# EAGLE board Jupiter Ace build024 (EAGLE 9.6.2), part 1 of 3
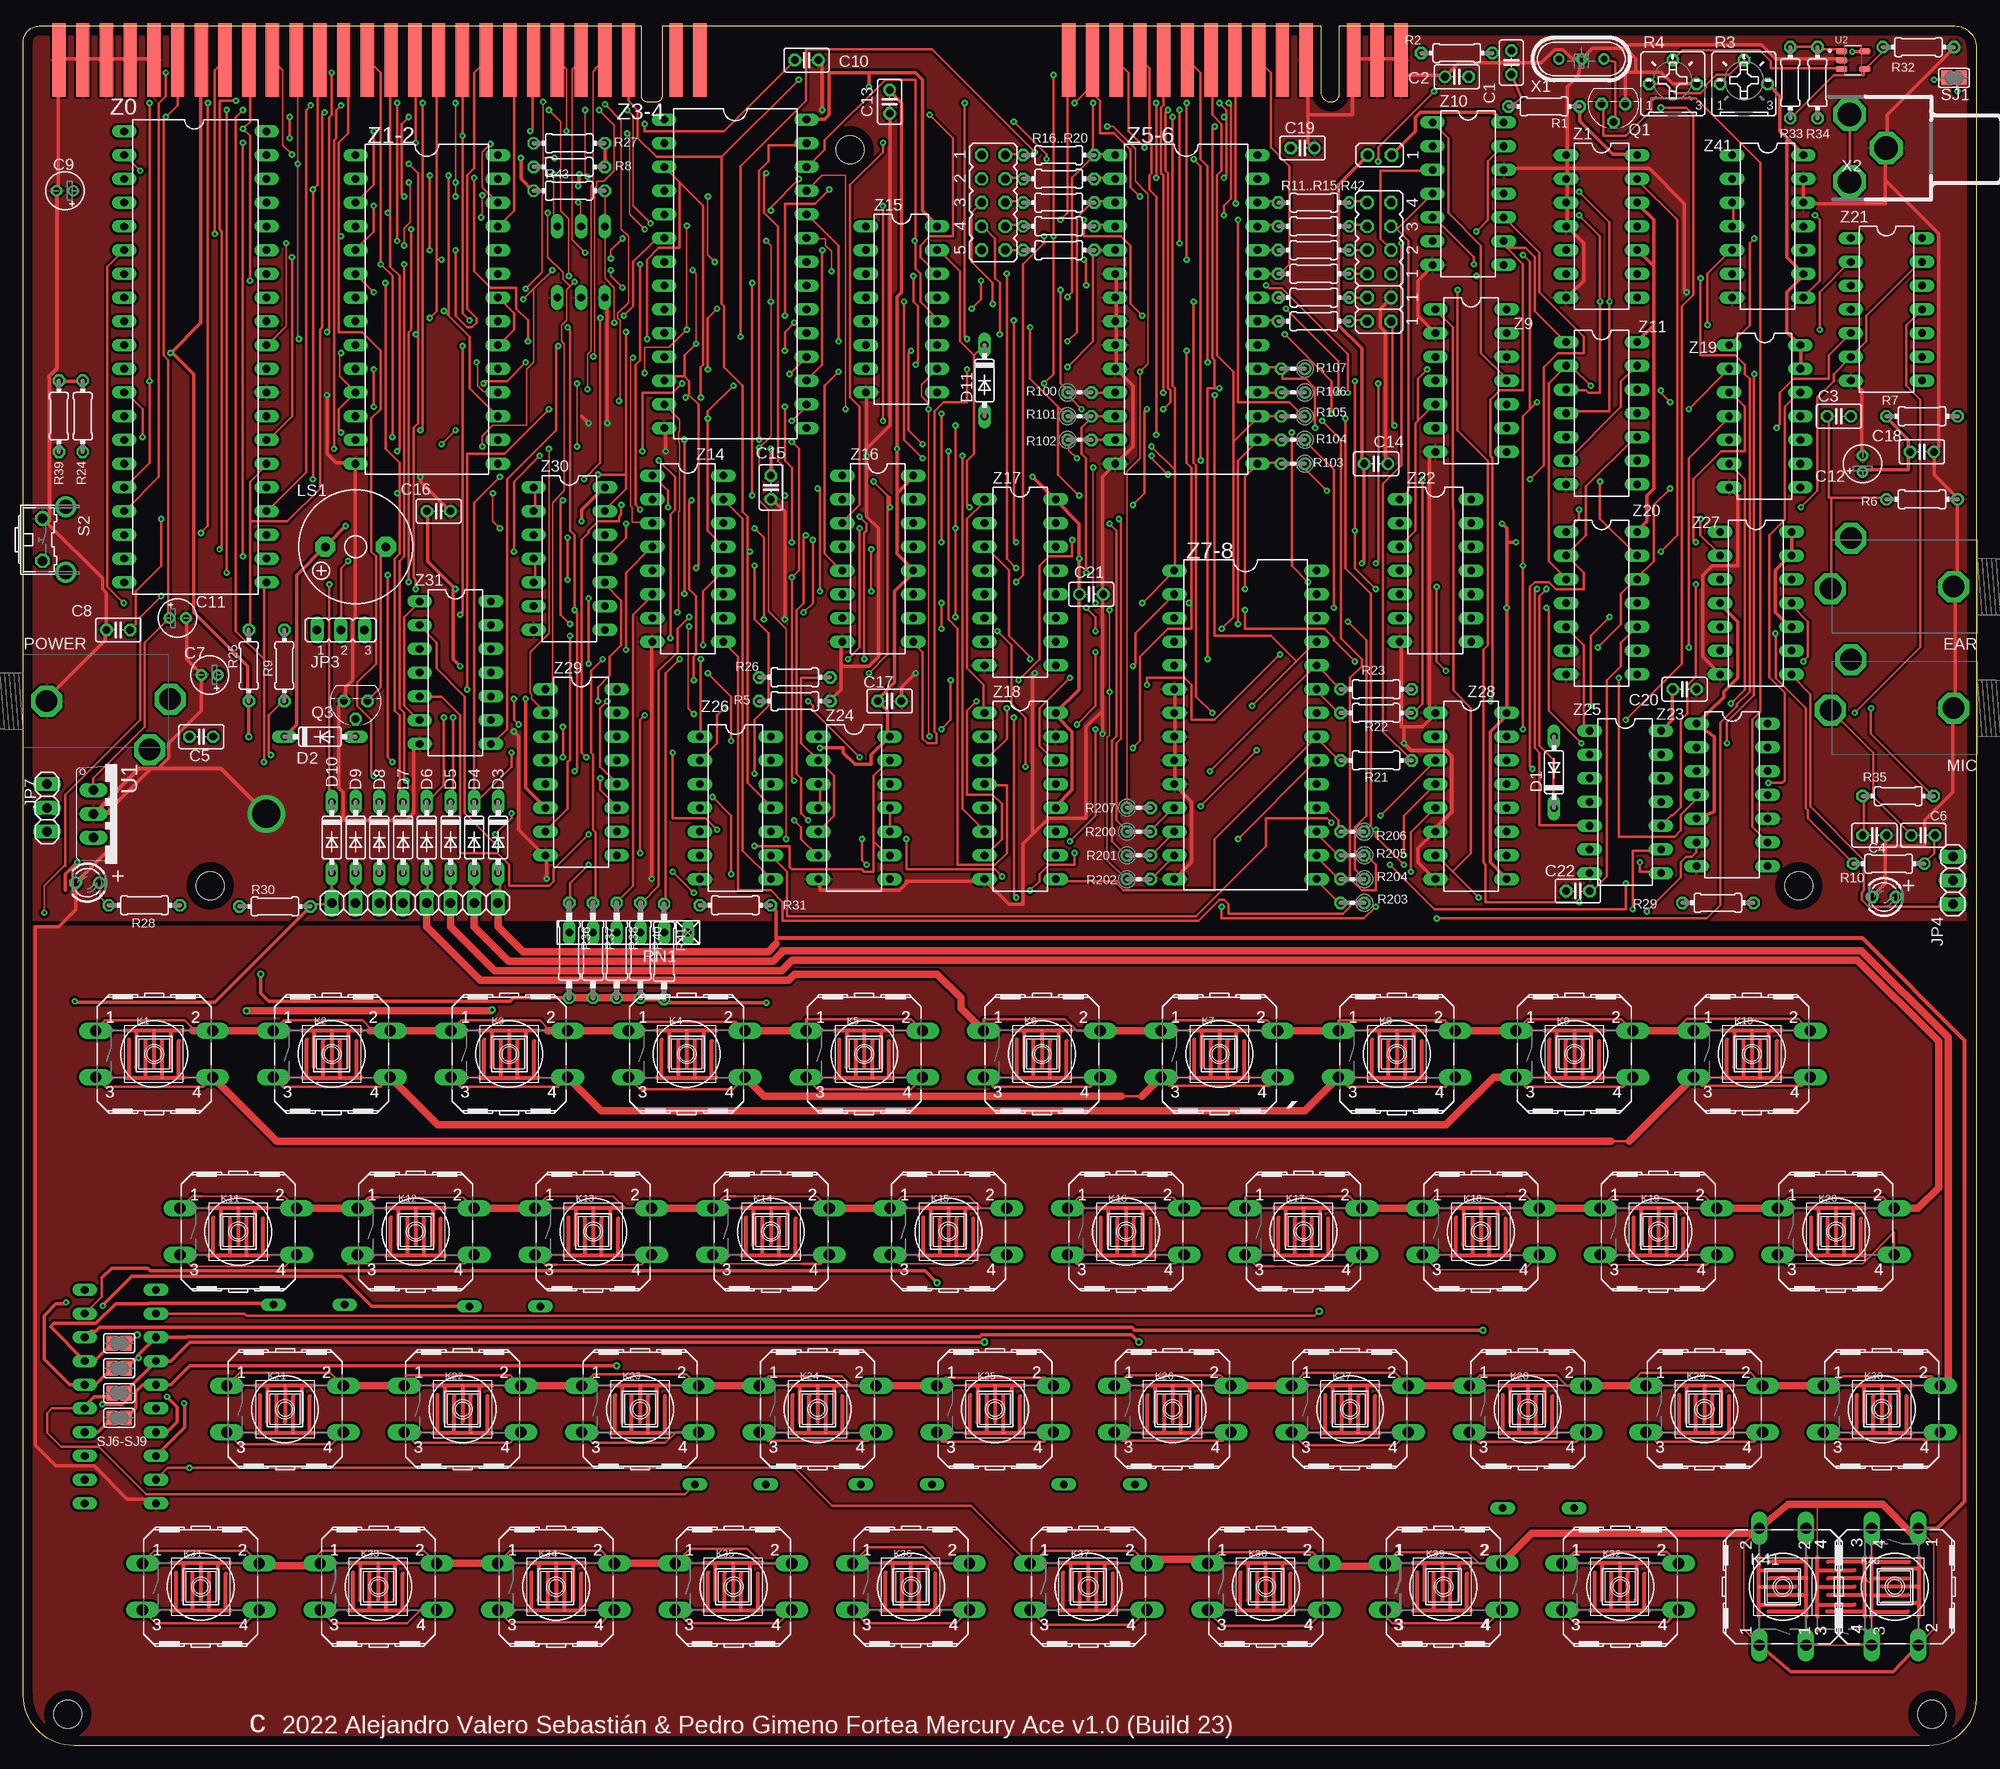
[diagram p6: board, top side]
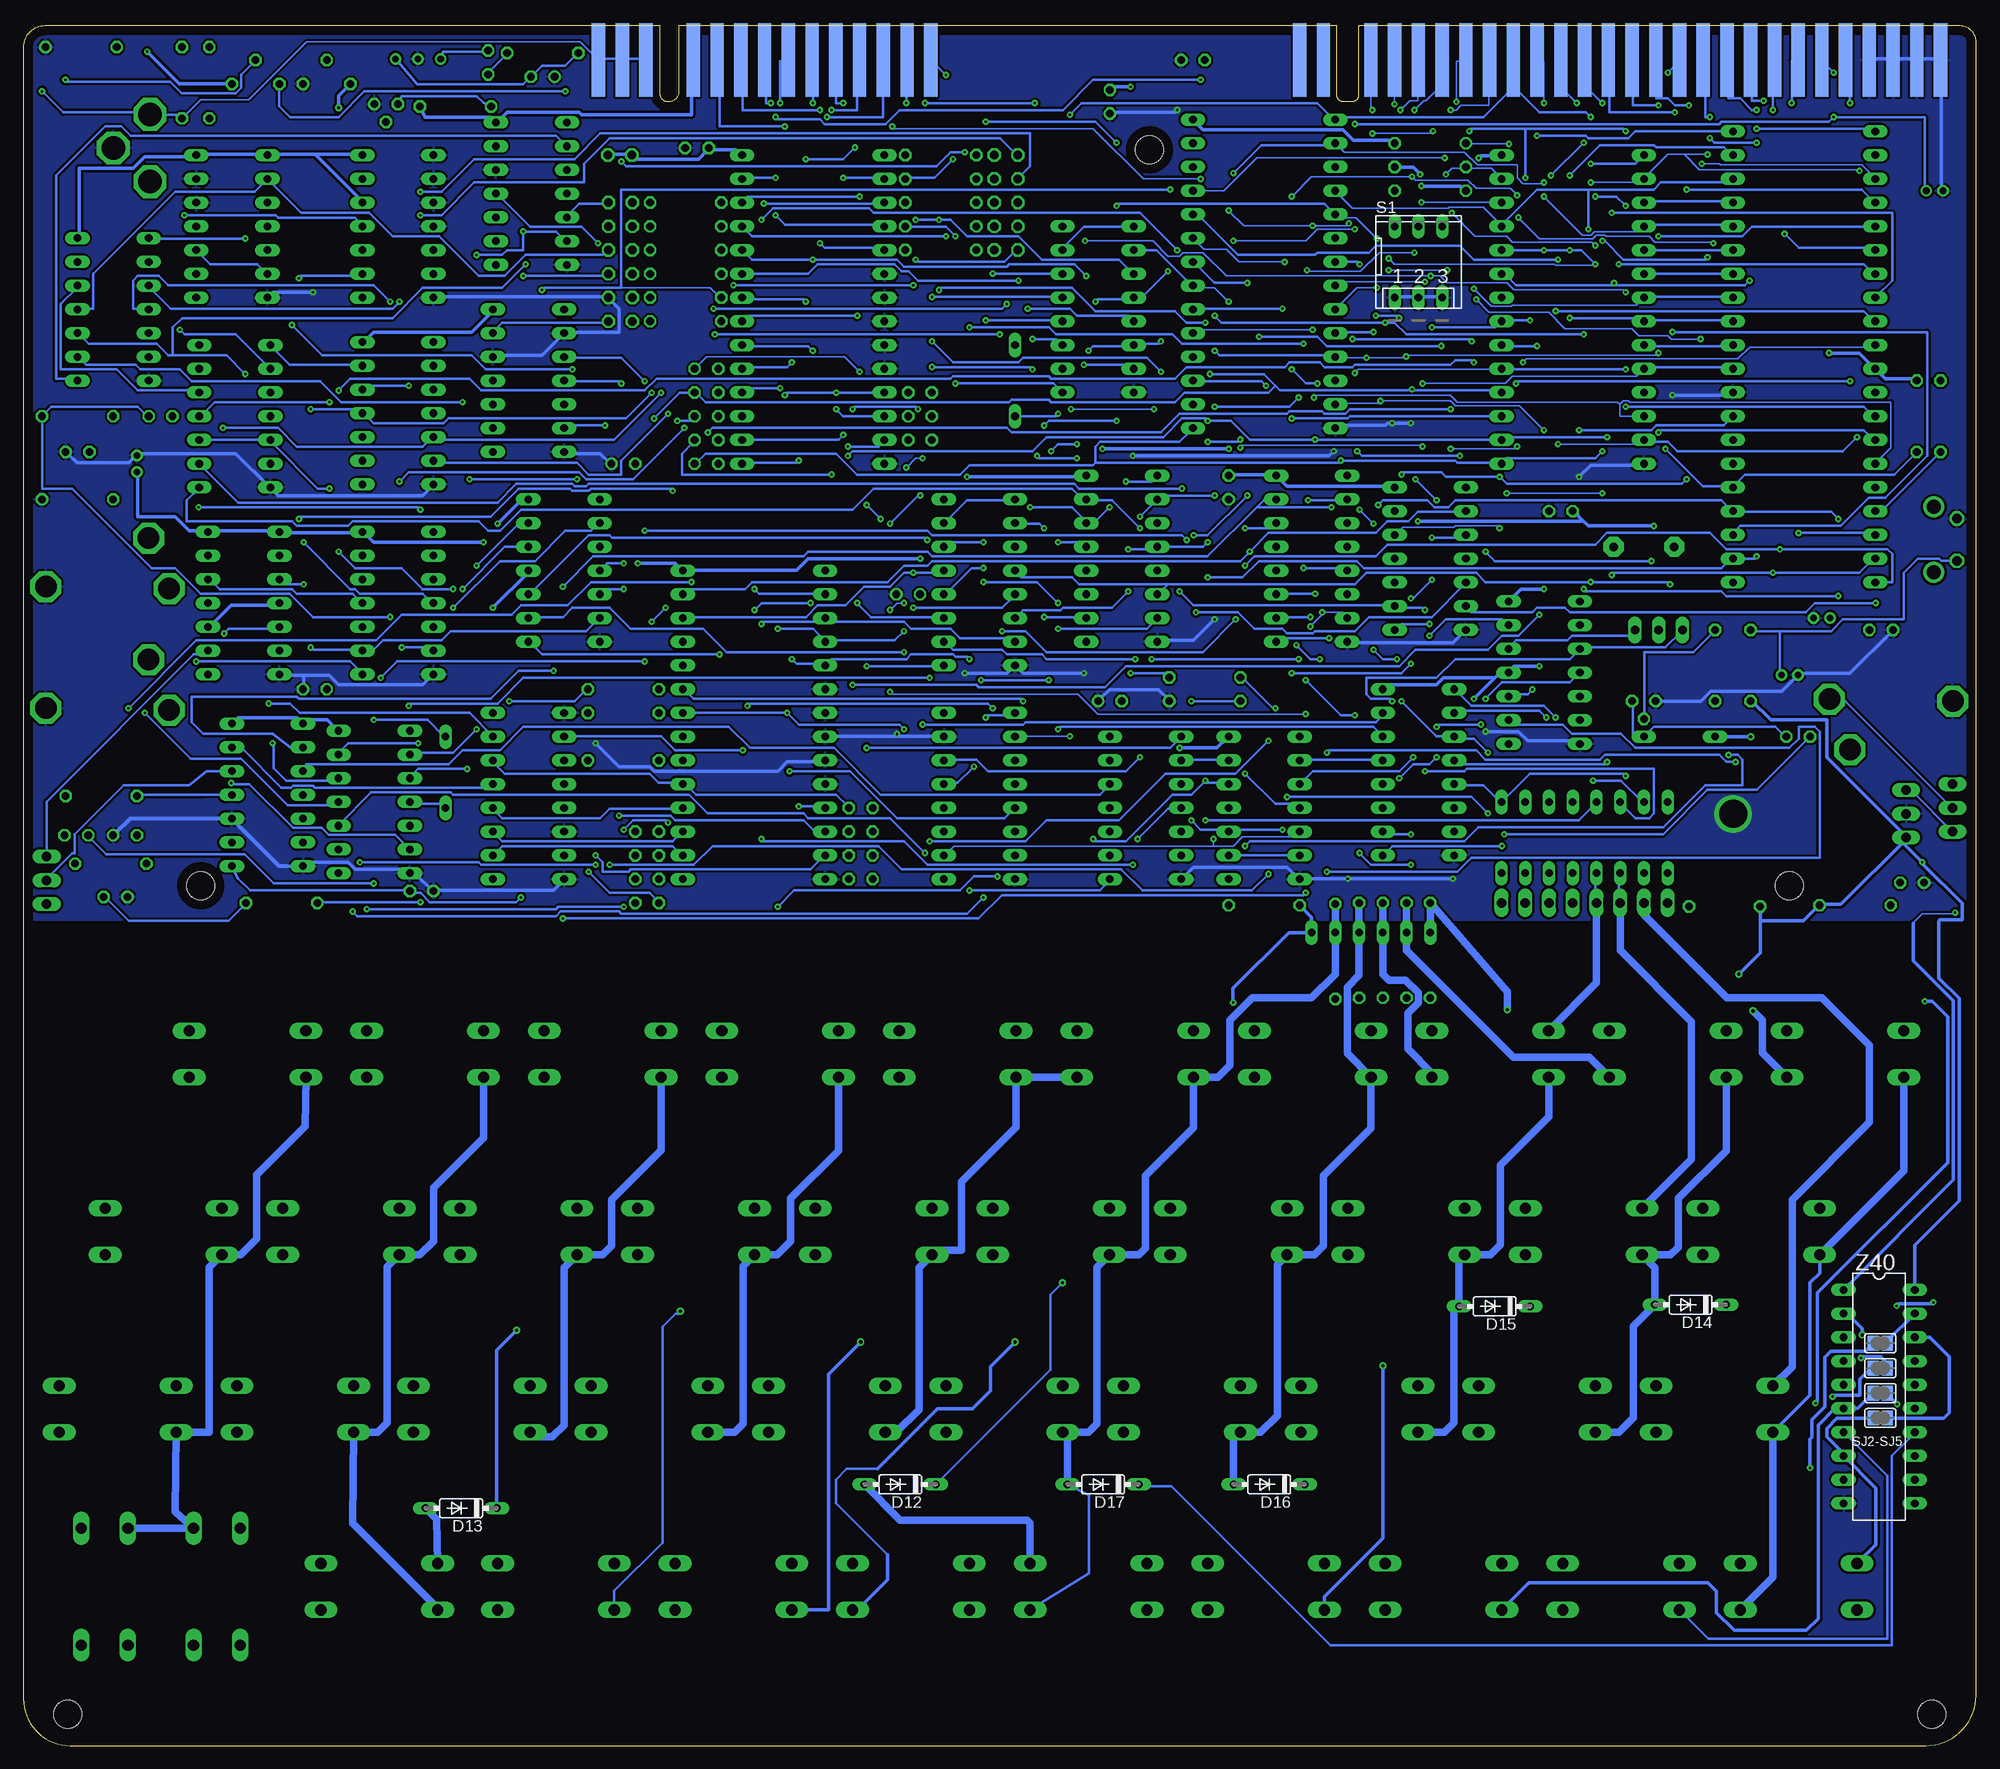
[diagram p7: board, bottom side, seen from below]

Size 209 x 184 mm. Coordinates in mm from the lower left corner, seen from the top.
Outline: 0,5.39 0,182.31 arc-90 1.69,184 66.1,184 66.1,176.56 arc90 66.77,175.9 67.77,175.9 arc90 68.4,176.53 68.4,184 138.86,184 138.86,176.98 arc90 139.96,175.87 arc90 140.86,176.77 140.86,184 206.72,184 arc-90 209,181.72 209,5.01 arc-90 203.99,0 5.39,0 arc-90 0,5.39
Copper layers (1*16): Top 0.035mm / dielectric 1.5mm / Bottom 0.035mm
Design rules "default *": minimum track width 6mil, minimum drill 10mil, track to track 8mil, track to pad 8mil, pad to pad 8mil, via to via 8mil, smd to smd 8mil, copper to edge 40mil, drill to drill 8mil, minimum pad ring 10mil, minimum via ring 8mil, stop-mask expansion 4mil, vias tented up to drill 0mil, thermal gap 10mil
Net classes: 0 default: width 0.1 mm; 1 power: width 0.4 mm
Holes 3 mm at 20,92 190,92 88.5,170.75 4.76,3.37 204.24,3.37
bKeepout: 1 lines
tRestrict: 1 lines
bRestrict: 1 lines
vRestrict: area 14,91.4 to 29.2,101.6

## Footprints (pad centres in the part's own frame; a part is rotated, then mirrored left to right if it is on the bottom)
EDGEPIN = smd 1.422 x 7.874: 1 0,0
C025-025X050 = drill 0.813 octagon: 1 -1.27,0; 2 1.27,0
E1,8-4 = drill 0.711 pad 1.168: + -0.889,0 | drill 0.711 pad 1.168 octagon: - 0.889,0
DO35-7 = drill 0.813 long: A 3.81,0; C -3.81,0
PJ302M = drill 2.3 pad 3.3 octagon: GND 2.5,0; SW 13.5,-5.2; TIP 15.7,0.2
1X08 = drill 1.016 long: 1 -8.89,0; 2 -6.35,0; 3 -3.81,0; 4 -1.27,0; 5 1.27,0; 6 3.81,0; 7 6.35,0; 8 8.89,0
JP2 = drill 0.914 long: 1 -2.54,0; 2 0,0; 3 2.54,0
1X03 = drill 1.016 long: 1 -2.54,0; 2 0,0; 3 2.54,0
JP1Q = drill 0.914 octagon: 1 -1.27,-1.27; 2 -1.27,1.27
JP4Q = drill 0.914 octagon: 1 -3.81,-1.27; 2 -3.81,1.27; 3 -1.27,-1.27; 4 -1.27,1.27; 5 1.27,-1.27; 6 1.27,1.27; 7 3.81,-1.27; 8 3.81,1.27
JP5Q = drill 0.914 octagon: 1 -5.08,-1.27; 2 -5.08,1.27; 3 -2.54,-1.27; 4 -2.54,1.27; 5 0,-1.27; 6 0,1.27; 7 2.54,-1.27; 8 2.54,1.27; 9 5.08,-1.27; 10 5.08,1.27
B3F-40XXNOHOLE = drill 1.194 long: 1 -6.248,2.489; 2 6.248,2.489; 3 -6.248,-2.489; 4 6.248,-2.489
LED3MM = drill 0.813 octagon: A -1.27,0; K 1.27,0
F/QMX = drill 0.914 pad 2.159 octagon: + 3.251,0; - -3.251,0
TO92 = drill 0.813 octagon: 1 1.27,0; 2 0,1.905; 3 -1.27,0
0204/7 = drill 0.813 octagon: 1 -3.81,0; 2 3.81,0
B25P = drill 0.813 octagon: A -2.54,0; E 2.54,0; S 0,2.54
0207/10 = drill 0.813 octagon: 1 -5.08,0; 2 5.08,0
0204V = drill 0.813 octagon: 1 -1.27,0; 2 1.27,0
RN-6 = drill 0.813 long: 1 -6.35,0; 2 -3.81,0; 3 -1.27,0; 4 1.27,0; 5 3.81,0; 6 6.35,0
DP-03 = drill 0.813 long: 1 -2.54,-3.81; 2 0,-3.81; 3 2.54,-3.81; 4 2.54,3.81; 5 0,3.81; 6 -2.54,3.81
B3F-31XX = drill 1.016 octagon: 1 -2.261,-1.245; 2 2.261,-1.245 | drill 1.499 pad 2.159: 3 -3.505,1.245; 4 3.505,1.245
SJ = smd 1.168 x 1.6: 1 -0.762,0; 2 0.762,0
TO220V = drill 1.016 long: 1 -2.54,-2.54; 2 0,-2.54; 3 2.54,-2.54
SOT95P280X145-5N = smd 1.22 x 0.6: 1 -1.245,0.95; 2 -1.245,0; 3 -1.245,-0.95; 4 1.245,-0.95; 5 1.245,0.95
CARBONB3F = smd 0.305 x 0.152: P$1 0,2.54; P$2 0.889,-2.54
HC49U = drill 0.7 pad 1.2: 1 -2.413,0; 2 -0.027,0; 3 2.413,0
CON-CONRAD_736880-49 = drill 2.5 pad 3.302 octagon: 1 -0.11,0; 2 3.81,3.595; 2@2 3.81,-3.595
DIL40 = drill 0.813 long: 1 -24.13,-7.62; 2 -21.59,-7.62; 3 -19.05,-7.62; 4 -16.51,-7.62; 5 -13.97,-7.62; 6 -11.43,-7.62; 7 -8.89,-7.62; 8 -6.35,-7.62; 9 -3.81,-7.62; 10 -1.27,-7.62; 11 1.27,-7.62; 12 3.81,-7.62; 13 6.35,-7.62; 14 8.89,-7.62; 15 11.43,-7.62; 16 13.97,-7.62; 17 16.51,-7.62; 18 19.05,-7.62; 19 21.59,-7.62; 20 24.13,-7.62; 21 24.13,7.62; 22 21.59,7.62; 23 19.05,7.62; 24 16.51,7.62; 25 13.97,7.62; 26 11.43,7.62; 27 8.89,7.62; 28 6.35,7.62; 29 3.81,7.62; 30 1.27,7.62; 31 -1.27,7.62; 32 -3.81,7.62; 33 -6.35,7.62; 34 -8.89,7.62; 35 -11.43,7.62; 36 -13.97,7.62; 37 -16.51,7.62; 38 -19.05,7.62; 39 -21.59,7.62; 40 -24.13,7.62
DIL14 = drill 0.813 long: 1 -7.62,-3.81; 2 -5.08,-3.81; 3 -2.54,-3.81; 4 0,-3.81; 5 2.54,-3.81; 6 5.08,-3.81; 7 7.62,-3.81; 8 7.62,3.81; 9 5.08,3.81; 10 2.54,3.81; 11 0,3.81; 12 -2.54,3.81; 13 -5.08,3.81; 14 -7.62,3.81
DIL28-6 = drill 0.813 long: 1 -16.51,-7.62; 2 -13.97,-7.62; 3 -11.43,-7.62; 4 -8.89,-7.62; 5 -6.35,-7.62; 6 -3.81,-7.62; 7 -1.27,-7.62; 8 1.27,-7.62; 9 3.81,-7.62; 10 6.35,-7.62; 11 8.89,-7.62; 12 11.43,-7.62; 13 13.97,-7.62; 14 16.51,-7.62; 15 16.51,7.62; 16 13.97,7.62; 17 11.43,7.62; 18 8.89,7.62; 19 6.35,7.62; 20 3.81,7.62; 21 1.27,7.62; 22 -1.27,7.62; 23 -3.81,7.62; 24 -6.35,7.62; 25 -8.89,7.62; 26 -11.43,7.62; 27 -13.97,7.62; 28 -16.51,7.62
DIL16 = drill 0.813 long: 1 -8.89,-3.81; 2 -6.35,-3.81; 3 -3.81,-3.81; 4 -1.27,-3.81; 5 1.27,-3.81; 6 3.81,-3.81; 7 6.35,-3.81; 8 8.89,-3.81; 9 8.89,3.81; 10 6.35,3.81; 11 3.81,3.81; 12 1.27,3.81; 13 -1.27,3.81; 14 -3.81,3.81; 15 -6.35,3.81; 16 -8.89,3.81
DIL20 = drill 0.813 long: 1 -11.43,-3.81; 2 -8.89,-3.81; 3 -6.35,-3.81; 4 -3.81,-3.81; 5 -1.27,-3.81; 6 1.27,-3.81; 7 3.81,-3.81; 8 6.35,-3.81; 9 8.89,-3.81; 10 11.43,-3.81; 11 11.43,3.81; 12 8.89,3.81; 13 6.35,3.81; 14 3.81,3.81; 15 1.27,3.81; 16 -1.27,3.81; 17 -3.81,3.81; 18 -6.35,3.81; 19 -8.89,3.81; 20 -11.43,3.81

## Placement (x,y rotation side)
1A  [EDGEPIN]  11.43,180.34 0 top
1A1  [EDGEPIN]  111.89,180.34 0 top
1B  [EDGEPIN]  11.43,180.34 0 bottom
1B1  [EDGEPIN]  111.89,180.34 0 bottom
2A  [EDGEPIN]  13.97,180.34 0 top
2A1  [EDGEPIN]  114.43,180.34 0 top
2B  [EDGEPIN]  13.97,180.34 0 bottom
2B1  [EDGEPIN]  114.43,180.34 0 bottom
3A  [EDGEPIN]  16.51,180.34 0 top
3A1  [EDGEPIN]  116.97,180.34 0 top
3B  [EDGEPIN]  16.51,180.34 0 bottom
3B1  [EDGEPIN]  116.97,180.34 0 bottom
4A  [EDGEPIN]  19.05,180.34 0 top
4A1  [EDGEPIN]  119.51,180.34 0 top
4B  [EDGEPIN]  19.05,180.34 0 bottom
4B2  [EDGEPIN]  119.51,180.34 0 bottom
5A  [EDGEPIN]  21.59,180.34 0 top
5A1  [EDGEPIN]  122.05,180.34 0 top
5B  [EDGEPIN]  21.59,180.34 0 bottom
5B2  [EDGEPIN]  122.05,180.34 0 bottom
6A  [EDGEPIN]  24.13,180.34 0 top
6A1  [EDGEPIN]  124.59,180.34 0 top
6B  [EDGEPIN]  24.13,180.34 0 bottom
6B2  [EDGEPIN]  124.59,180.34 0 bottom
7A  [EDGEPIN]  26.67,180.34 0 top
7A1  [EDGEPIN]  127.13,180.34 0 top
7B  [EDGEPIN]  26.67,180.34 0 bottom
7B2  [EDGEPIN]  127.13,180.34 0 bottom
8A  [EDGEPIN]  29.21,180.34 0 top
8A1  [EDGEPIN]  129.67,180.34 0 top
8B  [EDGEPIN]  29.21,180.34 0 bottom
8B2  [EDGEPIN]  129.67,180.34 0 bottom
9A  [EDGEPIN]  31.75,180.34 0 top
9A1  [EDGEPIN]  132.21,180.34 0 top
9B  [EDGEPIN]  31.75,180.34 0 bottom
9B1  [EDGEPIN]  132.21,180.34 0 bottom
10A  [EDGEPIN]  34.29,180.34 0 top
10A1  [EDGEPIN]  134.75,180.34 0 top
10B  [EDGEPIN]  34.29,180.34 0 bottom
10B1  [EDGEPIN]  134.75,180.34 0 bottom
11A  [EDGEPIN]  36.83,180.34 0 top
11A1  [EDGEPIN]  137.29,180.34 0 top
11B  [EDGEPIN]  36.83,180.34 0 bottom
11B1  [EDGEPIN]  137.29,180.34 0 bottom
12A  [EDGEPIN]  39.37,180.34 0 top
12B  [EDGEPIN]  39.37,180.34 0 bottom
13A  [EDGEPIN]  41.91,180.34 0 top
13A1  [EDGEPIN]  142.37,180.34 0 top
13B  [EDGEPIN]  41.91,180.34 0 bottom
13B1  [EDGEPIN]  142.37,180.34 0 bottom
14A  [EDGEPIN]  44.45,180.34 0 top
14A1  [EDGEPIN]  144.91,180.34 0 top
14B  [EDGEPIN]  44.45,180.34 0 bottom
14B1  [EDGEPIN]  144.91,180.34 0 bottom
15A  [EDGEPIN]  46.99,180.34 0 top
15A1  [EDGEPIN]  147.45,180.34 0 top
15B  [EDGEPIN]  46.99,180.34 0 bottom
15B1  [EDGEPIN]  147.45,180.34 0 bottom
16A  [EDGEPIN]  49.53,180.34 0 top
16B  [EDGEPIN]  49.53,180.34 0 bottom
17A  [EDGEPIN]  52.07,180.34 0 top
17B  [EDGEPIN]  52.07,180.34 0 bottom
18A  [EDGEPIN]  54.61,180.34 0 top
18B  [EDGEPIN]  54.61,180.34 0 bottom
19A  [EDGEPIN]  57.15,180.34 0 top
19B  [EDGEPIN]  57.15,180.34 0 bottom
20A  [EDGEPIN]  59.69,180.34 0 top
20B  [EDGEPIN]  59.69,180.34 0 bottom
21A  [EDGEPIN]  62.23,180.34 0 top
21B  [EDGEPIN]  62.23,180.34 0 bottom
22A  [EDGEPIN]  64.77,180.34 0 top
22B  [EDGEPIN]  64.77,180.34 0 bottom
24A  [EDGEPIN]  69.85,180.34 0 top
24B  [EDGEPIN]  69.85,180.34 0 bottom
25A  [EDGEPIN]  72.39,180.34 0 top
25B  [EDGEPIN]  72.39,180.34 0 bottom
26A  [EDGEPIN]  8.89,180.34 0 top
26B  [EDGEPIN]  8.89,180.34 0 bottom
27A  [EDGEPIN]  6.35,180.34 0 top
27B  [EDGEPIN]  6.35,180.34 0 bottom
28A  [EDGEPIN]  3.81,180.34 0 top
28B  [EDGEPIN]  3.81,180.34 0 bottom
C1  30pF  [C025-025X050]  159.26,180.09 270 top
C2  100pF  [C025-025X050]  153.42,178.56 180 top
C3  2.2uF  [C025-025X050]  194.31,142.24 0 top
C4  100nF  [C025-025X050]  198.12,97.41 180 top
C5  47pF  [C025-025X050]  19.05,107.95 0 top
C6  47nF  [C025-025X050]  203.33,97.41 0 top
C7  1uF  [E1,8-4]  19.94,114.55 180 top
C8  2.2nF  [C025-025X050]  10.16,119.38 180 top
C9  100uF  [E1,8-4]  4.45,166.37 180 top
C10  100nF  [C025-025X050]  83.82,180.34 0 top
C11  1uF  [E1,8-4]  16.51,120.65 0 top
C12  1uF  [E1,8-4]  196.85,137.16 90 top
C13  100nF  [C025-025X050]  92.71,175.9 90 top
C14  100nF  [C025-025X050]  144.78,137.16 180 top
C15  100nF  [C025-025X050]  80.01,134.62 90 top
C16  100nF  [C025-025X050]  44.45,132.08 180 top
C17  100nF  [C025-025X050]  92.71,111.76 180 top
C18  100nF  [C025-025X050]  203.2,138.43 180 top
C19  100nF  [C025-025X050]  136.91,170.94 180 top
C20  100nF  [C025-025X050]  177.8,113.03 180 top
C21  100nF  [C025-025X050]  114.3,123.19 180 top
C22  470pF  [C025-025X050]  166.37,91.44 0 top
D1  1N4148DO35-7  [DO35-7]  163.83,104.14 90 top
D2  1N4148DO35-7  [DO35-7]  31.75,107.95 0 top
D3  1N4148DO35-7  [DO35-7]  50.8,97.16 270 top
D4  1N4148DO35-7  [DO35-7]  48.26,97.16 270 top
D5  1N4148DO35-7  [DO35-7]  45.72,97.16 270 top
D6  1N4148DO35-7  [DO35-7]  43.18,97.16 270 top
D7  1N4148DO35-7  [DO35-7]  40.64,97.16 270 top
D8  1N4148DO35-7  [DO35-7]  38.1,97.16 270 top
D9  1N4148DO35-7  [DO35-7]  35.56,97.16 270 top
D10  1N4148DO35-7  [DO35-7]  33.02,97.16 270 top
D11  1N4148DO35-7  [DO35-7]  102.87,146.05 270 top
D12  1N4148DO35-7  [DO35-7]  115.16,27.94 180 bottom
D13  1N4148DO35-7  [DO35-7]  162.15,25.4 180 bottom
D14  1N4148DO35-7  [DO35-7]  30.57,47.18 180 bottom
D15  1N4148DO35-7  [DO35-7]  51.53,46.99 180 bottom
D16  1N4148DO35-7  [DO35-7]  75.66,27.94 180 bottom
D17  1N4148DO35-7  [DO35-7]  93.44,27.94 180 bottom
EAR  PJ302M  [PJ302M]  209.1,124 180 top
JP1  ROWS  [1X08]  41.91,90.17 0 top
JP3  MEMORY  [JP2]  33.97,119.38 0 top
JP4  VIDEO  [1X03]  206.5,92.58 270 top
JP5  [JP1Q]  145.1,153.67 90 top
JP6  ACE81_ENABLED  [JP1Q]  145.1,156.21 90 top
JP7  POWER  [1X03]  2.54,100.33 90 top
JP8  VCC  [JP1Q]  145.16,171.45 90 top
JP10  [JP4Q]  145.1,161.29 90 top
JP15  [JP5Q]  103.82,165.1 270 top
K1  1  [B3F-40XXNOHOLE]  14,74 0 top
K2  2  [B3F-40XXNOHOLE]  33,74 0 top
K3  3  [B3F-40XXNOHOLE]  52,74 0 top
K4  4  [B3F-40XXNOHOLE]  71,74 0 top
K5  5  [B3F-40XXNOHOLE]  90,74 0 top
K6  6  [B3F-40XXNOHOLE]  109,74 0 top
K7  7  [B3F-40XXNOHOLE]  128,74 0 top
K8  8  [B3F-40XXNOHOLE]  147,74 0 top
K9  9  [B3F-40XXNOHOLE]  166,74 0 top
K10  0  [B3F-40XXNOHOLE]  185,74 0 top
K11  Q  [B3F-40XXNOHOLE]  23,55 0 top
K12  W  [B3F-40XXNOHOLE]  42,55 0 top
K13  E  [B3F-40XXNOHOLE]  61,55 0 top
K14  R  [B3F-40XXNOHOLE]  80,55 0 top
K15  T  [B3F-40XXNOHOLE]  99,55 0 top
K16  Y  [B3F-40XXNOHOLE]  118,55 0 top
K17  U  [B3F-40XXNOHOLE]  137,55 0 top
K18  I  [B3F-40XXNOHOLE]  156,55 0 top
K19  O  [B3F-40XXNOHOLE]  175,55 0 top
K20  P  [B3F-40XXNOHOLE]  194,55 0 top
K21  A  [B3F-40XXNOHOLE]  28,36 0 top
K22  S  [B3F-40XXNOHOLE]  47,36 0 top
K23  D  [B3F-40XXNOHOLE]  66,36 0 top
K24  F  [B3F-40XXNOHOLE]  85,36 0 top
K25  G  [B3F-40XXNOHOLE]  104,36 0 top
K26  H  [B3F-40XXNOHOLE]  123,36 0 top
K27  J  [B3F-40XXNOHOLE]  142,36 0 top
K28  K  [B3F-40XXNOHOLE]  161,36 0 top
K29  L  [B3F-40XXNOHOLE]  179.9,36 0 top
K30  ENTER  [B3F-40XXNOHOLE]  198.9,36 0 top
K31  SHIFT  [B3F-40XXNOHOLE]  19,17 0 top
K32  SYMBOL  [B3F-40XXNOHOLE]  170.9,17 0 top
K33  Z  [B3F-40XXNOHOLE]  38,17 0 top
K34  X  [B3F-40XXNOHOLE]  57,17 0 top
K35  C  [B3F-40XXNOHOLE]  76,17 0 top
K36  V  [B3F-40XXNOHOLE]  95,17 0 top
K37  B  [B3F-40XXNOHOLE]  114,17 0 top
K38  N  [B3F-40XXNOHOLE]  133,17 0 top
K39  M  [B3F-40XXNOHOLE]  152,17 0 top
K40  SPACE  [B3F-40XXNOHOLE]  200.3,17 270 top
K41  SPACE  [B3F-40XXNOHOLE]  188.3,17 90 top
LED1  POWER  [LED3MM]  6.86,92.33 180 top
LED2  ACE81  [LED3MM]  199.14,90.81 180 top
LS1  F/QMX  [F/QMX]  35.56,128.27 180 top
MIC  PJ302M  [PJ302M]  209.1,111 180 top
POWER  PJ302M  [PJ302M]  0,111.76 0 top
Q1  2N3904  [TO92]  170.18,175.64 180 top
Q3  BC337  [TO92]  35.56,111.76 180 top
R1  1K  [0204/7]  162.75,175.39 180 top
R2  47K  [0204/7]  153.42,181.1 0 top
R3  500R  [B25P]  184.15,177.8 0 top
R4  1K  [B25P]  176.53,177.8 0 top
R5  12K  [0204/7]  82.55,111.76 180 top
R6  1K  [0204/7]  203.2,133.35 180 top
R7  33K  [0204/7]  203.2,142.24 180 top
R8  10K  [0204/7]  58.42,168.91 180 top
R9  22K  [0204/7]  27.94,115.57 270 top
R10  10K  [0204/7]  199.64,94.36 180 top
R11  1K  [0204/7]  138.11,152.4 180 top
R12  1K  [0204/7]  138.11,157.48 180 top
R13  1K  [0204/7]  138.11,160.02 180 top
R14  1K  [0204/7]  138.11,162.56 180 top
R15  1K  [0204/7]  138.11,165.1 180 top
R16  1K  [0204/7]  110.81,170.18 0 top
R17  1K  [0204/7]  110.81,167.64 0 top
R18  1K  [0204/7]  110.81,165.1 0 top
R19  1K  [0204/7]  110.81,162.56 0 top
R20  1K  [0204/7]  110.81,160.02 0 top
R21  1K  [0204/7]  144.78,105.41 180 top
R22  1K  [0204/7]  144.78,110.49 180 top
R23  1K  [0204/7]  144.78,113.03 180 top
R24  10K  [0204/7]  6.35,142.24 90 top
R25  220K  [0204/7]  24.13,115.57 270 top
R26  330  [0204/7]  82.55,114.3 0 top
R27  10K  [0204/7]  58.42,171.45 180 top
R28  680  [0204/7]  12.95,89.92 180 top
R29  680  [0204/7]  181.36,90.17 180 top
R30  4k7  [0204/7]  26.92,89.79 0 top
R31  4K7  [0204/7]  76.2,89.92 0 top
R32  200  [0204/7]  202.82,181.74 180 top
R33  200  [0204/7]  189.1,177.93 270 top
R34  75  [0204/7]  192.02,177.93 90 top
R35  300  [0204/7]  200.66,101.6 180 top
R36  4K7  [0207/10]  58.42,85.09 270 top
R37  4K7  [0207/10]  60.96,85.09 270 top
R38  4K7  [0207/10]  63.5,85.09 270 top
R39  10K  [0204/7]  3.81,142.24 90 top
R40  4K7  [0207/10]  66.04,85.09 270 top
R41  4K7  [0207/10]  68.58,84.96 270 top
R42  1K  [0204/7]  138.11,154.94 180 top
R43  10K  [0204/7]  58.42,166.37 0 top
R100  1K  [0204V]  113.03,144.78 0 top
R101  1K  [0204V]  113.03,142.24 0 top
R102  1K  [0204V]  113.03,139.7 0 top
R103  1K  [0204V]  135.89,137.16 180 top
R104  1K  [0204V]  135.89,139.7 180 top
R105  1K  [0204V]  135.89,142.24 180 top
R106  1K  [0204V]  135.89,144.78 180 top
R107  1K  [0204V]  135.89,147.32 180 top
R200  1K  [0204V]  119.38,97.79 0 top
R201  1K  [0204V]  119.38,95.25 0 top
R202  1K  [0204V]  119.38,92.71 0 top
R203  1K  [0204V]  142.24,90.17 180 top
R204  1K  [0204V]  142.24,92.71 180 top
R205  1K  [0204V]  142.24,95.25 180 top
R206  1K  [0204V]  142.24,97.79 180 top
R207  1K  [0204V]  119.38,100.33 0 top
RN1  4K7  [RN-6]  64.77,87 180 top
S1  [DP-03]  59.69,158.75 0 bottom
S2  RESET  [B3F-31XX]  3.3,129.03 270 top
SJ1  NO OPAMP  [SJ]  206.63,178.44 180 top
SJ2  [SJ]  10.26,43.05 180 top
SJ3  [SJ]  10.26,40.39 180 top
SJ4  [SJ]  10.26,37.72 180 top
SJ5  [SJ]  10.26,35.05 180 top
SJ6  [SJ]  10.26,40.39 180 bottom
SJ7  [SJ]  10.26,37.72 0 bottom
SJ8  [SJ]  10.26,35.05 0 bottom
SJ9  [SJ]  10.26,43.05 0 bottom
U1  7805  [TO220V]  10.03,99.69 270 top
U2  MAX4390EUK  [SOT95P280X145-5N]  195.83,180.34 0 top
U$1  40-XX-CARBON  [CARBONB3F]  13.97,74 0 top
U$2  40-XX-CARBON  [CARBONB3F]  33,74 0 top
U$3  40-XX-CARBON  [CARBONB3F]  52,74 0 top
U$4  40-XX-CARBON  [CARBONB3F]  71,74 0 top
U$5  40-XX-CARBON  [CARBONB3F]  90,74 0 top
U$6  40-XX-CARBON  [CARBONB3F]  109,74 0 top
U$7  40-XX-CARBON  [CARBONB3F]  128,74 0 top
U$8  40-XX-CARBON  [CARBONB3F]  147,74 0 top
U$9  40-XX-CARBON  [CARBONB3F]  166,74 0 top
U$10  40-XX-CARBON  [CARBONB3F]  185,74 0 top
U$11  40-XX-CARBON  [CARBONB3F]  23,55 0 top
U$12  40-XX-CARBON  [CARBONB3F]  42,55 0 top
U$13  40-XX-CARBON  [CARBONB3F]  61,55 0 top
U$14  40-XX-CARBON  [CARBONB3F]  80,55 0 top
U$15  40-XX-CARBON  [CARBONB3F]  99,55 0 top
U$16  40-XX-CARBON  [CARBONB3F]  118,55 0 top
U$17  40-XX-CARBON  [CARBONB3F]  137,55 0 top
U$18  40-XX-CARBON  [CARBONB3F]  156,55 0 top
U$19  40-XX-CARBON  [CARBONB3F]  175.01,54.99 0 top
U$20  40-XX-CARBON  [CARBONB3F]  194,55 0 top
U$21  40-XX-CARBON  [CARBONB3F]  28,36 0 top
U$22  40-XX-CARBON  [CARBONB3F]  47,36 0 top
U$23  40-XX-CARBON  [CARBONB3F]  66,36 0 top
U$24  40-XX-CARBON  [CARBONB3F]  85,36 0 top
U$25  40-XX-CARBON  [CARBONB3F]  104,36 0 top
U$26  40-XX-CARBON  [CARBONB3F]  123,36 0 top
U$27  40-XX-CARBON  [CARBONB3F]  142,36 0 top
U$28  40-XX-CARBON  [CARBONB3F]  161,36 0 top
U$29  40-XX-CARBON  [CARBONB3F]  179.9,36 0 top
U$30  40-XX-CARBON  [CARBONB3F]  198.9,36 0 top
U$31  40-XX-CARBON  [CARBONB3F]  19,17 0 top
U$32  40-XX-CARBON  [CARBONB3F]  170.84,17 0 top
U$33  40-XX-CARBON  [CARBONB3F]  37.95,17 0 top
U$34  40-XX-CARBON  [CARBONB3F]  57.04,17 0 top
U$35  40-XX-CARBON  [CARBONB3F]  75.95,17 0 top
U$36  40-XX-CARBON  [CARBONB3F]  94.95,17 0 top
U$37  40-XX-CARBON  [CARBONB3F]  113.95,17 0 top
U$38  40-XX-CARBON  [CARBONB3F]  132.95,17 0 top
U$39  40-XX-CARBON  [CARBONB3F]  151.85,17 0 top
U$40  40-XX-CARBON  [CARBONB3F]  188.3,17 90 top
U$41  40-XX-CARBON  [CARBONB3F]  194.56,17 90 top
U$42  40-XX-CARBON  [CARBONB3F]  200.3,17 270 top
X1  6.5MHz  [HC49U]  166.75,180.47 180 top
X2  CON-CONRAD_736880-49  [CON-CONRAD_736880-49]  199.26,170.94 180 top
Z0  Z80  [DIL40]  18.41,148.59 270 top
Z1  74LS74N  [DIL14]  168.91,162.56 270 top
Z1-2  27C512  [DIL28-6]  43.18,153.67 270 top
Z3-4  CY62256LL-PC  [DIL28-6]  76.2,157.48 270 top
Z5-6  CY62256LL-PC  [DIL28-6]  124.46,153.67 270 top
Z7-8  CY62256LL-PC  [DIL28-6]  130.81,109.22 270 top
Z9  74LS393N  [DIL14]  154.94,146.05 270 top
Z10  74LS393N  [DIL14]  154.62,166.05 270 top
Z11  74LS393N  [DIL14]  168.91,142.56 270 top
Z14  74367N  [DIL16]  71.12,127 270 top
Z15  74367N  [DIL16]  93.98,153.67 270 top
Z16  74367N  [DIL16]  91.44,127 270 top
Z17  74367N  [DIL16]  106.68,124.46 270 top
Z18  74367N  [DIL16]  106.68,101.6 270 top
Z19  74LS00N  [DIL14]  186.37,142.24 270 top
Z20  74LS08N  [DIL14]  168.91,122.24 270 top
Z21  74LS11N  [DIL14]  199.39,153.67 270 top
Z22  74LS11N  [DIL14]  151.13,125.73 270 top
Z23  74LS86N  [DIL14]  182.88,101.73 270 top
Z24  74LS02N  [DIL14]  88.9,100.33 270 top
Z25  74LS02N  [DIL14]  171.45,100.97 270 top
Z26  74LS32N  [DIL14]  76.2,100.33 270 top
Z27  74LS74N  [DIL14]  185.42,122.24 270 top
Z28  74LS166N  [DIL16]  154.94,101.6 270 top
Z29  74LS138N  [DIL16]  59.69,104.14 270 top
Z30  74LS00N  [DIL14]  58.42,127 270 top
Z31  74LS11N  [DIL14]  46.23,114.81 270 top
Z40  ATF16V8BP3  [DIL20]  10.38,37.34 270 bottom
Z41  74LS00N  [DIL14]  186.69,162.56 270 top

## Tracks (layer width: path | path; a pad name or v marks a point on that pad's centre or on a via)
9V  (via drill 0.25)
  Top 0.254: U1.1 7.5,102.25 7.5,103.5 13,109 13,118 15.5,120.5 C11.+ 15.5,120.75 15.5,148.25 15,148.75 15,174 v15.25,174.25 16.5,175.5 16.5,180.25 3A.1 | v66.5,173.5 66.5,172.75 75,172.75 82.5,180.25 C10.1
  Bottom 0.254: JP7.1 6.75,102 7.25,102 U1.1 | C9.+ 5.5,166.5 5.5,174.25 v15.25,174.25 15.75,173.75 27.25,173.75 27.5,173.5 v66.5,173.5
/BUSAK  (via drill 0.25)
  Top 0.254: v32.5,151.25 32.75,151.5 32.75,174.25 33,174.5 v33,179
  Bottom 0.254: v32.5,151.25 5.25,151.25 5.25,138 9.75,133.5 11.5,133.5 14.5,130.5 25.25,130.5 26,129.75 Z0.23 | v33,179 31.75,180.25 9B.1
/BUSRQ  (via drill 0.25)
  Top 0.254: v34,175.5 33.5,175 33.5,172 33.25,171.75 v33.25,138.75
  Bottom 0.254: R24.1 6.5,138.25 8.75,136 24.75,136 26,134.75 Z0.25 26.25,134.75 29.25,134.75 v33.25,138.75 | v34,175.5 36.75,175.5 36.75,180.25 11B.1
/HALT  (via drill 0.25)
  Top 0.254: v19,129.75 19.75,130.5 v19.75,175.75
  Bottom 0.254: v19,129.75 11,129.75 Z0.18 | v19.75,175.75 19.75,180.25 19.25,180.25 4B.1
/INT  (via drill 0.25)
  Top 0.254: v13.5,175.75 v13.5,146 13.5,137.25 11,134.75 Z0.16 | v176.25,143.75 175.25,144.75 v175.25,145 | v53.75,148 51.75,146 49.25,146 v49.25,145.75
  Bottom 0.254: v13.5,175.75 13.5,180.25 13.75,180.25 2B.1 | v176.25,143.75 188.5,143.75 190,142.25 Z19.11 | v175.25,145 174,146.25 161.25,146.25 160,145 142.5,145 141.25,146.25 109.75,146.25 109.5,146.5 99.25,146.5 99,146.25 85.75,146.25 84.5,147.5 74,147.5 73.5,148 70.25,148 69.75,147.5 66.75,147.5 66.5,147.75 56.25,147.75 55.75,148.25 54,148.25 v53.75,148 | v49.25,145.75 49,146 v13.5,146
/IORQ  (via drill 0.25)
  Top 0.254: v78.25,104 78.25,109.75 79.75,111.25 79.75,119 78.25,120.5 v78.25,126.25 | v22.75,176 21,176 21,162.25 21.25,162 21.25,128.25 v21,128
  Bottom 0.254: v78.25,104 75,100.75 72.75,100.75 72.5,100.5 Z26.4 | v78.25,126.25 77.25,127.25 64.25,127.25 63,128.5 40.75,128.5 39.5,129.75 28.5,129.75 26.75,128 v21,128 9.5,128 9,127.5 9,124.5 10.75,124.5 Z0.20 | v22.75,176 24,176 24,180.25 6B.1
/M1  (via drill 0.25)
  Top 0.254: v28.75,159.25 28.75,142.25 26.25,139.75 Z0.27 | v40,175.75 v40,161
  Bottom 0.254: v28.75,159.25 29,159 37.75,159 39.75,161 v40,161 | v40,175.75 41.75,177.5 41.75,180.25 13B.1
/MREQ  (via drill 0.25)
  Top 0.254: v39.5,105.25 39,105.75 v39,125.25 | v21.75,125.5 v21.75,175
  Bottom 0.254: v39.5,105.25 39.75,105 55.5,105 55.75,105.25 Z29.4 | v39,125.25 38.75,125.5 v21.75,125.5 12.5,125.5 11,127 Z0.19 | v21.75,175 21.75,180.25 5B.1
/NMI  (via drill 0.25)
  Top 0.254: v15.25,179 15.25,176.5 14.5,175.75 14.5,135.75 11,132.25 Z0.17
  Bottom 0.254: R39.1 4,138.25 10,132.25 10.75,132.25 Z0.17 | v15.25,179 16.5,180.25 3B.1
/RD  (via drill 0.25)
  Top 0.254: v74.25,98 73,99.25 69.5,99.25 v69.5,106.25 | 25.75,116.25 25.75,124 26,124.25 Z0.21 | 25.75,116.25 v25.75,105.25 | v78,133.75 v78,156.5 | v83.75,129.5 83.5,129.25 83.5,122.25 82.75,121.5 82.75,104 83.25,103.5 83.25,99.75 v84,99 | v23.5,175 22.75,174.25 22.75,119.25 25.75,116.25
  Bottom 0.254: v74.25,98 80,98 Z26.10 80.25,98 83,98 v84,99 | v69.5,106.25 69.25,106.5 53.5,106.5 52.5,105.5 40.25,105.5 39.75,106 27.5,106 26.75,105.25 v25.75,105.25 | v78,156.5 81.5,156.5 83.75,158.75 Z3-4.22 | v78,133.75 82.25,129.5 v83.75,129.5 | v23.5,175 24,175 25.25,176.25 26.5,176.25 26.5,180.25 7B.1
/RFSH  (via drill 0.25)
  Top 0.254: v42.5,140.75 42.75,141 v42.75,175.75
  Bottom 0.254: v42.5,140.75 34.75,140.75 34.25,141.25 27,141.25 26.25,142 Z0.28 | v42.75,175.75 44.25,177.25 44.25,180.25 14B.1
/VHOLD  (via drill 0.25)
  Top 0.254: v72.5,116.25 72.5,108 Z26.1 | v88.25,116.25 89.5,117.5 v89.5,130.25
  Bottom 0.254: v88.25,116.25 v72.5,116.25 | v89.5,130.25 92.5,133.25 95.25,133.25 Z16.15 95.25,133.5 95.75,133.5 96.75,134.5 118,134.5 120.25,132.25 155.75,132.25 158,130 159.25,130 160.25,131 173.75,131 174.25,130.5 179.75,130.5 180.25,131 191.5,131 191.5,133.25 190.25,134.5 Z19.8
/WAIT  (via drill 0.25)
  Top 0.254: v14.75,131.25 14.75,126.25 12,123.5 12,120 11.5,119.5 C8.1 | v60.25,105.75 59.75,106.25 59.75,129 60.5,129.75 60.5,130 61.5,131 63.75,131 63.75,131.5 64,131.75 v64,132.75 | v30.75,175.5 30.25,175 30.25,136.25 26.25,132.25 Z0.24
  Bottom 0.254: v14.75,131.25 15.5,132 26,132 Z0.24 26.25,132.25 27.25,133.25 55.75,133.25 56.5,132.5 58,132.5 58.75,133.25 63.5,133.25 v64,132.75 | v60.25,105.75 61.75,104.25 71,104.25 72.25,103 Z26.3 | v30.75,175.5 32.25,175.5 33,176.25 34.25,176.25 34.25,180.25 10B.1
/WE1  (via drill 0.25)
  Top 0.254: v128.5,167.75 128.75,168 128.75,174.25 | 128.75,174.25 128.75,175 v128,175.75 | 77.5,127.5 77.5,103 80,100.5 Z26.11 | v77.75,127.75 77.5,127.5 | Z30.1 54.75,134.5 54.75,132.25 Z30.2 | 74.75,170 67.75,170 65.75,172 65.75,175 64.75,176 64.75,180.25 22A.1 | 74.75,170 74.75,154.25 75,154 75,147.5 77,145.5 77,132 77.5,131.5 77.5,127.5 | v128.5,174.25 128.75,174.25 | 74.75,170 v83,178.25
  Bottom 0.254: v128.5,167.75 132,167.75 Z5-6.27 | v128,175.75 128,180.25 127.25,180.25 7B2.1 | Z30.2 54.75,132 59.75,132 60.75,131 63,131 64.25,129.75 75.75,129.75 v77.75,127.75 78.75,126.75 111.75,126.75 112.25,126.25 114.75,126.25 116.5,124.5 131,124.5 131.75,123.75 137.75,123.75 138.25,123.25 Z7-8.27 | v128.5,174.25 128.25,174 123.75,174 123.25,173.5 116.75,173.5 115.25,175 97.75,175 94.5,178.25 v83,178.25
/WR  (via drill 0.25)
  Top 0.254: v82.5,103.25 82.25,103.5 v82.25,125 83,125.75 83,138.75 v82.25,139.5 | v78.75,139.75 78.75,168.5 79.75,169.5 79.75,171.25 83.75,171.25 Z3-4.27 | v172.25,89.5 172.25,95.75 175.25,95.75 Z25.9 | v144.75,89.75 143.5,88.5 128.25,88.5 v128.25,89.75 | v104.75,93 104,93.75 94.5,93.75 v94.5,97 | v28.5,172 v28.5,174.25 | v23.5,127.25 v23.5,171.5
  Bottom 0.254: v82.25,125 78.5,125 76.75,126.75 66.25,126.75 65.5,126 27.25,126 26.25,127 Z0.22 23.75,127 v23.5,127.25 | Z26.12 80.25,103 82.25,103 v82.5,103.25 84,101.75 86,101.75 91,96.75 94.25,96.75 v94.5,97 | v78.75,139.75 79,139.5 v82.25,139.5 | v172.25,89.5 152,89.5 151.75,89.75 v144.75,89.75 | v128.25,89.75 126.5,91.5 108.75,91.5 107.25,93 v104.75,93 | v28.5,174.25 29,174.25 29,180.25 8B.1 | v28.5,172 28,171.5 v23.5,171.5
A0  (via drill 0.25)
  Top 0.152: v59.25,139 v59.25,145.75 | v58.12,172.75 58.12,179.38 57.25,180.25 19A.1 | v64.62,172.5 64.88,172.25 64.88,163.88 v66.5,162.25 | v79.5,161 80,160.5 v80,154.5 80,140.12 v78.75,138.88 78.75,133.25 79.75,132.25 79.75,121.38 81.62,119.5 v81.62,97
  Bottom 0.152: 81.62,96.25 109.38,96.25 110.38,95.25 Z18.10 | 81.62,96.25 79.5,96.25 78.5,97.25 73,97.25 72.5,97.75 Z26.5 | v59.25,145.75 50.38,145.75 49.62,146.5 36.38,146.5 35.62,147.25 Z1-2.10 | v59.25,139 59.38,139.12 78.5,139.12 v78.75,138.88 | v80,154.5 81.5,156 83.62,156 83.75,156.12 Z3-4.21 | v58.12,172.75 58.38,172.5 v64.62,172.5 | v66.5,162.25 70.5,162.25 71.75,161 v79.5,161 | v81.62,97 81.62,96.25
  Bottom 0.254: Z0.30 26.25,147.5 35.5,147.5 Z1-2.10 | Z3-4.21 84,156.25 87.75,160 90,160 Z15.2
A1  (via drill 0.25)
  Top 0.152: v86.5,157.75 86.5,159.88 85.88,160.5 85.88,161.25 83.88,161.25 Z3-4.23 | v74,158.75 73.25,159.5 v73.25,165.75 | v60.38,167.88 60.12,168.12 v60.12,175 | v28.12,160.75 28.12,151.88 26.12,149.88 Z0.31 | v49,163.5 49.12,163.62 v49.12,165.88
  Top 0.254: v100.5,138 100.5,100.25 102.75,98 Z18.6 | v96.25,137.75 94.25,139.75 v94.25,154.5
  Bottom 0.152: v86.5,157.75 89.25,155 90.12,155 Z15.4 | v74,158.75 78.88,158.75 80.25,160.12 82.62,160.12 83.75,161.25 Z3-4.23 | v73.25,165.75 71.12,167.88 v60.38,167.88 60,167.5 54.38,167.5 53.5,166.62 49.88,166.62 v49.12,165.88 | v60.12,175 59.12,176 58.88,176 57.25,177.62 57.25,180.25 19B.1 | v28.12,160.75 28.25,160.88 34.38,160.88 35,161.5 39.62,161.5 39.75,161.62 40.62,161.62 41,161.25 46.75,161.25 v49,163.5
  Bottom 0.254: Z0.31 26.25,149.75 35.5,149.75 Z1-2.9 | v100.5,138 100.25,137.75 v96.25,137.75 | v94.25,154.5 94,154.75 90.25,154.75 Z15.4
A2  (via drill 0.25)
  Top 0.254: v43.5,152.75 44.25,153.5 44.25,159 | 44.25,159 44.25,180.25 14A.1 | v99,138.5 99,120.5 100,119.5 100,94.25 104,94.25 105.25,95.5 105.25,102.75 103,102.75 Z18.4 | v96.25,139.25 94.75,140.75 94.75,149 v95,149.25 | v87.25,150.25 87.25,160.5 84,163.75 Z3-4.24 | v44.75,159 44.25,159
  Bottom 0.254: Z0.32 26.25,152.5 35.5,152.5 Z1-2.8 35.75,152.5 36,152.75 v43.5,152.75 | v99,138.5 98.25,139.25 v96.25,139.25 | v95,149.25 94.5,149.75 90.25,149.75 Z15.6 90,150 87.5,150 v87.25,150.25 | v44.75,159 53.75,159 55.25,160.5 64.25,160.5 65,159.75 70.5,159.75 70.75,159.5 79,159.5 83.25,163.75 83.75,163.75 Z3-4.24
A3  (via drill 0.25)
  Top 0.152: v53.75,155.88 55.5,157.62 55.5,165.88 55.62,166 55.62,169.88 | v55.62,175.88 55.62,169.88 | v97,108 96.88,108.12 v96.88,143 96.88,143.62 96.12,144.38 96.12,145.62 97.75,147.25 Z15.10 | v88,143 88,168 85.5,168 83.88,166.38 Z3-4.25 | v56.88,169.88 55.62,169.88
  Bottom 0.152: Z1-2.7 36.38,154.12 49.62,154.12 49.75,154 51.88,154 v53.75,155.88 | v55.62,175.88 55.62,180.25 54.62,180.25 18B.1 | v97,108 102.75,108 Z18.2 | v96.88,143 v88,143 | v56.88,169.88 77,169.88 80.5,166.38 83.75,166.38 Z3-4.25
  Bottom 0.254: Z0.33 26.25,155 35.5,155 Z1-2.7
A4  (via drill 0.25)
  Top 0.152: v37.5,155.5 35.62,157.38 Z1-2.6 | v95.38,161 95.5,161 | v56.25,175 57.5,173.75 57.5,164.25 58.38,163.38 v58.38,157.25
  Top 0.254: v106.25,128.75 106,129 v106,152.5 | Z3-4.26 84,169 85.75,170.75 85.75,171.75 92.25,178.25 95.5,178.25 95.5,161 95.5,158 96,157.5 96,154.5 97.75,152.75 97.75,152.5 Z15.12
  Bottom 0.152: v37.5,155.5 37.75,155.75 49.5,155.75 50.25,156.5 56.62,156.5 57.38,157.25 v58.38,157.25 80.25,157.25 82.75,159.75 84.88,159.75 85.25,159.38 86.5,159.38 88.12,161 v95.38,161 | v56.25,175 55.62,175 55.12,175.5 52.12,175.5 52.12,180.25 17B.1
  Bottom 0.254: Z0.34 26.25,157.5 35.5,157.5 Z1-2.6 | v106.25,128.75 110,128.75 110.25,128.5 Z17.14 | v106,152.5 98,152.5 Z15.12
A5  (via drill 0.25)
  Top 0.254: v37.5,164.75 37.5,162 35.75,160.25 Z1-2.5 | v40.75,165.75 40.5,166 40.5,173.5 v41.25,174.25 | v97,174.5 99.5,172 99.5,161.5 97,161.5 96,160.5 96,159.25 97.75,157.5 Z15.14 | v106.25,126 105.25,127 v105.25,157.5
  Bottom 0.254: Z0.35 26.25,160 35.5,160 Z1-2.5 | v37.5,164.75 38.5,165.75 v40.75,165.75 | v41.25,174.25 41.75,174.75 46.75,174.75 49.5,177.5 | 49.5,177.5 49.5,180.25 16B.1 49.5,177.5 | v97,174.5 95.75,175.75 70.5,175.75 69,174.25 | 69,174.25 68.75,174 Z3-4.1 69,174.25 | v106.25,126 107.5,126 110.25,123.25 Z17.12 | v105.25,157.5 98,157.5 Z15.14 | 49.5,177.5 52.75,174.25 69,174.25
A6  (via drill 0.25)
  Top 0.152: v46.25,175.75 v46.25,167.25 v46.25,165.75
  Top 0.254: v90,116.25 90,129.75 90.25,130 90.25,130.75 v89.5,131.5 | v81.5,133.75 81.25,134 81.25,137 80.75,137.5 80.75,162.5 79.25,164 79.25,168 v79.5,168.25
  Bottom 0.152: v46.25,165.75 42.12,161.62 41.25,161.62 40.88,162 36.12,162 35.62,162.5 Z1-2.4 | v46.25,175.75 46.25,180.25 46.88,180.25 15B.1 | v46.25,167.25 46.38,167.12 48.5,167.12 49.12,167.75 49.12,169.12 53.38,169.12 54.75,170.5 67.62,170.5 68.5,171.38 Z3-4.2
  Bottom 0.254: v90,116.25 99.5,116.25 100,116.75 103.75,116.75 104.25,117.25 109.5,117.25 110.25,118 Z17.10 | v89.5,131.5 87.75,133.25 Z16.2 87.5,133.5 87.25,133.75 v81.5,133.75 | Z0.36 26.25,162.75 35.5,162.75 Z1-2.4 | v79.5,168.25 76.5,171.25 68.75,171.25 Z3-4.2
A7  (via drill 0.25)
  Top 0.254: v37.5,172.75 37.5,167 35.75,165.25 Z1-2.3 | v54.25,172.75 54.5,173 54.5,180.25 18A.1 | v90.75,123.5 v90.75,128 | 70.25,167.25 72.75,164.75 72.75,147.75 72.5,147.5 v72.5,144.25 | 70.25,167.25 68.75,168.75 Z3-4.3 | v81.5,143.25 81.5,137.5 82.25,136.75 v82.25,128.75 | v48.25,167.75 48.25,157.75 50,156 52.75,156 52.75,153.75 54,152.5 v54,150.25 | v66.75,150.5 66.75,159 68,160.25 70.25,160.25 70.25,167.25
  Bottom 0.254: Z0.37 26.25,165.25 35.5,165.25 Z1-2.3 | v37.5,172.75 37.75,173 48.25,173 | 48.25,173 54,173 v54.25,172.75 | v90.75,128 88,128 87.75,128.25 Z16.4 87.5,128.25 82.75,128.25 v82.25,128.75 | v90.75,123.5 92.5,121.75 97.75,121.75 98,121.5 102,121.5 102.75,120.75 Z17.6 | v72.5,144.25 73.5,143.25 v81.5,143.25 | v48.25,167.75 48.25,173 | v54,150.25 54.25,150.5 v66.75,150.5
A8  (via drill 0.25)
  Top 0.254: Z1-2.25 51,162.75 52.5,164.25 52.5,180 52.25,180.25 17A.1 | v32.75,124.25 32.75,101.25 33,101 D10.C | v41.5,162.25 41.5,151.5 41.25,151.25 v41.25,124.5
  Bottom 0.152: Z3-4.4 68.5,166.25 66.75,164.5 56.5,164.5 56.38,164.62 52.75,164.62 50.88,162.75 Z1-2.25
  Bottom 0.254: 41.5,166.5 47,166.5 50.75,162.75 Z1-2.25 | 41.5,166.5 34.5,166.5 33.75,167.25 26.5,167.25 26.25,167.5 Z0.38 | v32.75,124.25 33,124.5 v41.25,124.5 52.5,124.5 53.5,125.5 65.25,125.5 66.5,124.25 86.5,124.25 | 86.5,124.25 87.5,123.25 Z16.6 | 86.5,124.25 96,124.25 96.75,125 102.25,125 102.75,125.5 Z17.4 | v41.5,162.25 41.5,166.5
A9  (via drill 0.25)
  Top 0.152: v64.12,161.25 62.88,160 v62.88,159.12
  Top 0.254: v99.75,120.75 v99.75,130.25 v99.75,141.25 | v41,103.25 40.75,103.5 40.75,110.5 40.25,111 40.25,126.75 40.75,127.25 v40.75,158.5 | v43.5,160 v43.5,168 | v46.25,160 46.25,153 47.5,151.75 48,151.75 48.5,152.25 48.5,152.75 47.5,153.75 47.5,168 48.25,168.75 48.25,179 49.5,180.25 16A.1 | v92,164.75 v92,141.75
  Bottom 0.152: v64.12,161.25 66.38,163.5 68.12,163.5 68.38,163.75 Z3-4.5 | v62.88,159.12 62.25,158.5 45.12,158.5 45,158.38 40.75,158.38 v40.75,158.5
  Bottom 0.254: v99.75,120.75 95.25,120.75 Z16.10 | v99.75,130.25 100.25,130.75 102.75,130.75 Z17.2 | v41,103.25 38,103.25 35.75,101 D9.C | v40.75,158.5 42.25,160 v43.5,160 v46.25,160 50.75,160 Z1-2.24 | v43.5,168 40.25,171.25 34.5,171.25 34.25,171 27,171 26.25,170.25 Z0.39 | v99.75,141.25 99.25,141.75 v92,141.75 | v92,164.75 91.75,165 69.75,165 Z3-4.5
A10  (via drill 0.25)
  Top 0.254: 15A.1 47,180.25 v47,172.25 47,153.25 v47.75,152.5 | v59,104.25 59.25,104.5 59.25,121.25 v59,121.5 59,129.5 58.5,130 58.5,151.5 v58.25,151.75 | v85,134.5 85.25,134.25 v85.25,123.5
  Bottom 0.254: v47,172.25 41.75,172.25 41.5,172 37.25,172 36.5,172.75 26.25,172.75 Z0.40 | v47.75,152.5 50.75,152.5 Z1-2.21 51,152.25 51.5,151.75 v58.25,151.75 | v59,104.25 54.75,104.25 54.5,104.5 34.5,104.5 34.5,99.75 35,99.25 36.5,99.25 38,100.75 D8.C | v59,121.5 59.25,121.75 62,121.75 Z30.9 62.25,122 83.75,122 v85.25,123.5 | v85,134.5 96,134.5 96.5,135 148.5,135 148.75,134.75 150,134.75 150.25,135 156.25,135 158.25,133 186,133 190,137 Z19.9
A10'  (via drill 0.25)
  Top 0.254: v58.5,120 57.5,121 57.5,133 v57.75,133.25 | v60,135.5 61.75,137.25 v61.75,152.75 | v64.25,153 65.25,154 65.25,158.75 67.75,161.25 68.5,161.25 Z3-4.6
  Bottom 0.254: v58.5,120 61.5,120 62,119.5 Z30.8 | v60,135.5 v57.75,133.25 | v61.75,152.75 62,153 v64.25,153
A11  (via drill 0.25)
  Top 0.152: v51,130.25 50.25,131 v50.25,134 | v40,134 40.25,134
  Top 0.254: v82.5,99 83.25,98.25 83.25,97 85,95.25 Z24.6 | 6A.1 24.25,180.25 24.25,173.75 v23.5,173 24.25,172.25 v24.25,156.75 | v38.75,156.5 38.75,138.75 40.25,137.25 40.25,134 40.25,127.5 39.75,127 39.75,110.75 40.25,110.25 40.25,101.25 40.5,101 D7.C
  Bottom 0.152: v51,130.25 51.25,130.5 55.75,130.5 55.88,130.38 61.38,130.38 62.12,129.62 Z30.12 | v40,134 v50.25,134
  Bottom 0.254: v82.5,99 42.5,99 40.75,100.75 D7.C | v23.5,173 11.25,173 11,172.75 Z0.1 | v24.25,156.75 24.75,156.25 38.75,156.25 | 38.75,156.25 49.25,156.25 50.25,157.25 50.75,157.25 Z1-2.23 | 38.75,156.25 v38.75,156.5
A11'  (via drill 0.25)
  Top 0.254: v64.5,130.75 64.5,129.25 62.25,127 Z30.11 | v66,132.25 65.5,132.75 65.5,147.75 66,148.25 v66,158.5
  Bottom 0.254: v66,132.25 v64.5,130.75 | v66,158.5 66.25,158.75 Z3-4.7
A12  (via drill 0.25)
  Top 0.152: v28.75,170.25 27.75,171.25 27.75,179.25 26.75,180.25 7A.1 | v12.5,168.5 10.88,170.12 Z0.2 | 58.5,156.12 58.12,155.75 58.12,152.5 57.62,152 57.62,150.25 57.88,150 57.88,134.25 56.62,133 56.62,113.75 56,113.12 Z29.1 | 58.5,156.12 v59,156.62 | v41.25,167.25 41.38,167.12 41.38,163 40.75,162.38 v40.75,160.5 | v56.12,164 56.12,159.25 57.75,157.62 57.75,156.88 58.5,156.12
  Top 0.254: v45,110 45,102.75 43.25,101 D6.C
  Bottom 0.152: v28.75,170.25 31.25,170.25 | 31.25,170.25 33,170.25 35.5,167.75 Z1-2.2 35.62,167.62 36,167.25 v41.25,167.25 | v12.5,168.5 12.62,168.62 29.62,168.62 31.25,170.25 | v59,156.62 68.12,156.62 68.5,156.25 Z3-4.8 | v40.75,160.5 41.12,160.88 49.62,160.88 50.25,161.5 53.62,161.5 v56.12,164
  Bottom 0.254: v45,110 46.25,111.25 54,111.25 55.75,113 Z29.1
A13  (via drill 0.25)
  Top 0.152: v64.12,156 62.88,157.25 v62.88,157.88 | v53.5,154.75 54.62,155.88 | 54.62,155.88 v56.62,157.88 | v29.5,150.5 29.38,150.62 v29.38,169.25 29.38,180.12 29.25,180.25 8A.1 | v56.25,138.75 56.25,119 54.25,117 54.25,112.62 54.38,112.5 54.38,112 Z29.2 | v49.12,139 49.12,140.12 50.25,141.25 53.88,141.25 53.88,147.25 54.62,148 54.62,155.88
  Top 0.254: v46,110 46,101.25 45.75,101 D5.C
  Bottom 0.152: Z3-4.9 66.25,156 v64.12,156 | v56.62,157.88 v62.88,157.88 | v53.5,154.75 52.12,153.38 45.75,153.38 44,151.62 36.88,151.62 36.12,150.88 33,150.88 32.62,150.5 v29.5,150.5 | v29.38,169.25 27.5,169.25 27.38,169.12 12.25,169.12 10.88,167.75 Z0.3 | v56.25,138.75 49.38,138.75 v49.12,139
  Bottom 0.254: v46,110 46.75,110.75 55.5,110.75 55.75,110.5 Z29.2
A14  (via drill 0.25)
  Top 0.254: 9A.1 31.75,180.25 31.5,180 31.5,167 v31,166.5 v31,135.5 | v64.5,151.25 64.5,136 | 64.5,136 64.5,134.5 62.25,132.25 Z30.13 | v52.25,106.25 52.25,104.75 48.5,101 D4.C 48.25,101 48.25,133 v51,135.75 | v61.5,111.75 61.5,113.25 62.75,114.5 62.75,116.5 64,117.75 64,122.5 62.25,124.25 Z30.10 | v61.5,136 64.5,136
  Bottom 0.254: v31,166.5 12.25,166.5 11,165.25 Z0.4 | v64.5,151.25 68.5,151.25 Z3-4.10 | v52.25,106.25 53.75,107.75 55.75,107.75 Z29.3 56,108 57.75,108 v61.5,111.75 | v61.5,136 61.25,136.25 57.25,136.25 56.75,135.75 v51,135.75 50.25,135 31.5,135 v31,135.5
A15  (via drill 0.25)
  Top 0.254: 33.75,161.75 v34,161.5 | 33.75,161.75 33.75,171.5 34.75,172.5 34.75,180 34.5,180.25 10A.1 | v37.5,103.75 37.25,104 37.25,109.75 35.75,111.25 35.75,113.75 37.75,115.75 37.75,127.25 37.25,127.75 37.25,142 38.25,143 38.25,149.25 36.25,151.25 33.75,151.25 33.75,161.75
  Bottom 0.254: Z29.5 55.75,102.75 52.75,102.75 51,101 D3.C 50.75,101 47.75,104 37.75,104 v37.5,103.75 | v34,161.5 25,161.5 24,162.5 11,162.5 Z0.5
ACE81_ENABLED  (via drill 0.25)
  Top 0.152: R43.2 62.25,166.25 62.25,162.62 S1.6 62.25,162.5 62.25,157 63.25,156 v63.25,152.25 | v2.25,89.12 2.25,92 4.38,94.12 4.5,94.16
  Top 0.254: v166.5,90.25 156.5,90.25 156.5,94.25 156.25,94.5 156.25,117.25 156.75,117.75 156.75,137.5 153.5,140.75 v153.5,155.75 | v41.25,169.25 42.25,168.25 42.25,151 | 42.25,151 42.25,141.5 41.75,141 41.75,125 42,124.75 v42,123.75 | v14.75,123 12.5,120.75 12.5,109.75 4.5,101.75 4.5,94.16 | v86.25,166.5 84.75,165 81.5,165 v81.5,153 | 42.25,151 v42,151
  Bottom 0.152: 145,156 135.5,156 134.5,155 R42.2 | v2.25,89.12 2.38,89 5.75,89 6.62,88.12 6.73,88.01
  Bottom 0.254: v166.5,90.25 177.5,90.25 R29.2 | v153.5,155.75 153.25,156 145,156 145,166.5 v86.25,166.5 | v41.25,169.25 36.5,169.25 35.75,170 Z1-2.1 | v42,123.75 41.75,123.5 27.25,123.5 26.75,123 v14.75,123 | v81.5,153 80.75,152.25 v63.25,152.25 62.25,152.25 61,151 v42,151
  Bottom 0.4: Z40.1 2.42,60.54 2.42,79.69 6.73,84 6.73,88.01
AMPLIF_IN
  Top 0.254: U2.3 194.5,179.5 187,179.5 187,180.25 185.87,181.38 177.57,181.38 R4.S
AMPLIF_OUT
  Top 0.254: U2.1 194.5,181.5 192.25,181.5 R34.2 192,181.75 189.25,181.75 R33.1
CLK  (via drill 0.25)
  Top 0.254: v155.75,90.75 153,93.5 | 153,93.5 151.25,95.25 Z28.7 | 153,93.5 153,93.56 154.94,95.5 154.94,111 153.03,112.9 153,151.75 151.25,153.5 Z9.1 | Z20.10 172.5,119.5 171,118 171,115.5 169.5,114 169.5,93 167.75,91.25 C22.2
  Bottom 0.254: v155.75,90.75 156.25,90.25 165.5,90.25 166.5,91.25 167.5,91.25 C22.2 167.75,91.5 184.75,91.5 186.02,92.77 Z23.8
CNT0  (via drill 0.25)
  Top 0.254: Z30.5 54.75,124.5 54.75,127 Z30.4 | v144.75,123.75 142.5,126 v142.5,130 v142.5,146 | v83.5,121.25 84.5,122.25 v84.5,129
  Bottom 0.254: v144.75,123.75 146.75,123.75 147.25,123.25 Z22.5 | v142.5,146 145,148.5 151,148.5 Z9.3 | v83.5,121.25 79,121.25 77.25,119.5 74.25,119.5 73.75,119 71,119 70.75,119.25 66.5,119.25 65,120.75 58.25,120.75 54.75,124.25 Z30.5 | v84.5,129 85,129.5 111.75,129.5 112.25,130 v142.5,130
CNT1  (via drill 0.25)
  Top 0.254: v144.75,126.5 145,126.75 v145,145.75
  Bottom 0.254: v144.75,126.5 146.5,126.5 147.25,125.75 Z22.4 | v145,145.75 145.25,146 151,146 Z9.4
CNT2  (via drill 0.25)
  Top 0.254: 149.25,141.75 151,143.5 Z9.5 | 149.25,141.75 149,141.5 149,130 147.5,128.5 Z22.3 | v180.25,152 180.25,157.5 182.75,160 Z41.5 | v150.25,147.25 149.25,146.25 149.25,141.75
  Bottom 0.254: v180.25,152 177,148.75 161,148.75 159.5,147.25 v150.25,147.25
CNT3  (via drill 0.25)
  Top 0.254: v146.75,141.25 146.5,141.5 146.5,152.25 JP5.1
  Bottom 0.254: v146.75,141.25 150.75,141.25 151,141 Z9.6 | Z9.13 158.75,151.25 157.75,152.25 146.5,152.25 JP5.1
CNT4  (via drill 0.25)
  Top 0.254: 156,157.25 156,160.5 152.5,164 152.5,172 151,173.5 Z10.1 | 156,157.25 156,149 158.75,146.25 Z9.11 | 156,157.25 v155.5,157.25
  Bottom 0.254: v155.5,157.25 146.5,157.25 JP10.1
CNT5  (via drill 0.25)
  Top 0.254: Z10.3 150.75,168.5 145.25,168.5 145.25,161.25 146.25,160.25 JP10.3 | v196,110.5 203,117.5 203,144 201.5,145.5 201.5,152 203,153.5 Z21.11
  Bottom 0.254: Z25.11 175.61,100.62 180.71,100.62 185.71,105.61 191.12,105.61 v196,110.5 | Z21.11 203,153.75 201.5,153.75 201.5,157.5 192.75,166.25 184.25,166.25 183,167.5 Z41.2 182.75,167.5 179.25,164 172,164 169.5,161.5 164.5,161.5 160.25,157.25 157.5,157.25 155.25,159.5 147,159.5 146.5,160 JP10.3
CNT6
  Top 0.254: 147,162.25 146.5,162.75 JP10.5 147,162.25 | 147,162.25 148.25,161 148.25,134.25 147.5,133.5 Z22.1 | 147,162.25 150.75,166 Z10.4
CNT7  (via drill 0.25)
  Top 0.254: v155.25,158.5 155.25,159.25 151,163.5 Z10.5 | v185.25,146.75 185.21,146.71 185.21,112.38 182.33,109.5 v182.33,107.27
  Bottom 0.254: Z10.5 150.75,163.75 149.5,165 146.5,165 JP10.7 | Z25.12 175.52,103.24 180.84,103.24 182.2,104.6 182.2,107.14 v182.33,107.27 | v185.25,146.75 187.25,148.75 193,148.75 | 193,148.75 193.5,148.75 194.75,150 202,150 203,151 Z21.10 | v155.25,158.5 157.75,156 166.25,156 169.5,152.75 192,152.75 193,151.75 193,148.75
CNT8  (via drill 0.25)
  Top 0.254: v155.5,162 156.75,163.25 156.75,169.5 158.25,171 Z10.13 | v160.5,108.75 v160.5,126.25 160.5,142.25 161.25,143 | 161.25,143 v162,143.75 | v160.5,159.5 161.25,158.75 161.25,143
  Bottom 0.254: Z10.6 151,161 152,162 v155.5,162 155.5,160 157.25,160 157.75,159.5 v160.5,159.5 | v160.5,108.75 163,106.25 167.5,106.25 Z25.2 | v160.5,126.25 156,130.75 155,130.75 Z22.13 | v162,143.75 175,143.75 177.25,146 191,146 192.25,147.25 196.5,147.25 197,147.75 202.25,147.75 203,148.5 Z21.9
CNT9  (via drill 0.25)
  Top 0.254: R21.1 145.5,108.5 145.5,135 147.5,137 v147.5,160.75
  Bottom 0.254: v147.5,160.75 149.25,162.5 154.75,162.5 158.25,166 Z10.11
CNT10  (via drill 0.25)
  Top 0.254: v149.75,135.5 149.75,111.5 148.75,110.5 R22.1 | v161.25,135.5 162.75,137 162.75,147.5 164.25,149 167,149 167,150.75 162.25,155.5 162.25,159.75 158.5,163.5 Z10.10
  Bottom 0.254: v161.25,135.5 v149.75,135.5
CNT11  (via drill 0.25)
  Top 0.254: v157,111.75 157.25,112 157.25,137.75 157,138 157,144 158,145 160.5,145 160.5,158.5 158.75,160.25 | 158.75,160.25 158.5,160.5 158.5,160.75 Z10.9 | 158.75,160.25 160.75,160.25 161.75,159.25 161.75,153.5 165,150.25 Z11.1
  Bottom 0.254: v157,111.75 150,111.75 148.75,113 R23.1
CNT12  (via drill 0.25)
  Top 0.254: Z11.3 165.25,145 167.25,145 167.5,144.75 168.75,144.75 v168.75,154.5 168.75,161.5 v166.5,163.75
  Bottom 0.254: v168.75,154.5 169.5,153.75 193.25,153.75 195.5,156 Z21.3 | v166.5,163.75 164.25,163.75 160.75,167.25 149,167.25 149,169.25 146.25,172 104.5,172 102.75,170.25 JP15.1
CNT13  (via drill 0.25)
  Top 0.254: Z11.4 165.25,142.75 169.75,142.75 v169.75,154.5 169.75,163 v166.5,166.25
  Bottom 0.254: v169.75,154.5 171.5,156.25 193.5,156.25 194.5,157.25 196.75,157.25 197.25,156.75 197.25,153.75 195.75,153.75 Z21.4 | v166.5,166.25 164.25,166.25 160.75,169.75 150,169.75 147.25,172.5 101.25,172.5 101.25,169 102.5,167.75 JP15.3
CNT14  (via drill 0.25)
  Top 0.254: v187.64,141 188,141.36 188,144.75 189.5,146.25 193.25,146.25 193.25,148.75 195.5,151 Z21.5 | v103.75,154.25 103.75,156.5 101.5,158.75 101.5,164 102.5,165 JP15.5 | v135.13,153.75 140.75,148.13 v140.75,144.75
  Bottom 0.254: 165.5,139.75 166.25,139 179.75,139 181.75,141 v187.64,141 | 165.5,139.75 165.25,140 Z11.5 165.5,139.75 | v103.75,154.25 104.25,153.75 v135.13,153.75 | v140.75,144.75 145.75,139.75 165.5,139.75
CNT15  (via drill 0.25)
  Top 0.254: Z11.6 165.25,137.5 171,143.25 171,146 172.5,147.5 Z11.13 | v185.25,161.25 184.75,160.75 184.75,152 182.75,150 Z19.1 | v104.5,151 104.5,156.5 104,157 104,161.25 102.75,162.5 JP15.7 | v135,151 140,146 v140,142.5
  Bottom 0.254: Z19.1 182.5,149.75 180.5,147.75 172.75,147.75 Z11.13 | v185.25,161.25 195.5,161.25 Z21.1 | v135,151 v104.5,151 | v140,142.5 145,137.5 145,136 148.5,136 149.75,137.25 165,137.25 Z11.6
CNT16  (via drill 0.25)
  Top 0.254: v178.25,143 182.5,147.25 Z19.2 | v192.25,151.5 192.25,155.5 195.5,158.75 Z21.2 | v113.5,159 113.75,158.75 v113.75,156.25 | v141.75,144.75 141.75,148.89 134.71,155.93 133.32,155.93 v133,156.25
  Bottom 0.254: v178.25,143 173,143 172.75,142.75 Z11.11 172.5,142.5 171.5,141.5 164,141.5 163.5,142 144.5,142 v141.75,144.75 | v192.25,151.5 191.75,151 186.25,151 182.75,147.5 Z19.2 | v113.5,159 113.25,158.75 104,158.75 102.75,160 JP15.9 | v133,156.25 v113.75,156.25
CNT17  (via drill 0.25)
  Top 0.254: v161.5,104.5 161.25,104.75 161.25,124 161.75,124.5 163.25,124.5 164,123.75 167,123.75 167,125.5 165.25,127.25 Z20.2 165.25,127.5 167.25,129.5 167.25,134.75 172.5,140 Z11.10
  Bottom 0.254: v161.5,104.5 166.75,104.5 167.5,103.75 Z25.3
D0  (via drill 0.25)
  Top 0.152: v65.25,148.5 65,148.25 65,132.62 65.12,132.5 65.12,130.88 67.25,130.88 Z14.3 | v61.62,175 63.25,173.38 63.25,168.5 62.12,167.38 61.38,167.38 61.38,166.88 61.12,166.62 61.12,148.75 v61,148.62 | v34,149 33.88,148.88 33.88,146.5 35.5,144.88 Z1-2.11
  Top 0.254: v34,140.5 33.75,140.75 33.75,143 35.5,144.75 Z1-2.11 | v111,155.75 111,145.75 111.75,145 R100.1 112,144.75 112,144.25 v113.25,143 | v82.5,152.25 81.5,151.25 v81.5,149.25 | v117.25,131.25 117.5,131 117.5,107.75 117,107.25 117,99 118,98 R200.1 | v118.75,132.75 120,134 120,142.75 v120.25,143
  Bottom 0.152: Z3-4.11 68.5,148.5 v65.25,148.5 61.12,148.5 v61,148.62 60.88,148.75 34.25,148.75 v34,149 | v61.62,175 60.62,176 59.75,176 59.75,180.25 20B.1
  Bottom 0.254: v34,140.5 33.75,140.75 12,140.75 11,139.75 Z0.14 | v111,155.75 110.75,156 96.75,156 94.25,153.5 85.75,153.5 84.5,152.25 v82.5,152.25 | v81.5,149.25 81,148.75 68.75,148.75 Z3-4.11 | v118.75,132.75 v117.25,131.25 | v120.25,143 120,143.25 113.5,143.25 v113.25,143
D1  (via drill 0.25)
  Top 0.152: v60.12,159.75 58.75,161.12 58.75,179.38 59.62,180.25 20A.1 | v71.62,157.88 72,157.5 v72,150 | v70.88,144.25 71.12,144.5 71.25,144.5
  Top 0.254: v72,126 72.25,126.25 72.25,143.5 71.25,144.5 71.25,146 70.75,146.5 | 70.75,146.5 68.75,146.5 68.75,146.25 Z3-4.12 | 110.75,143.25 107.75,146.25 v107.75,151.75 | 110.75,143.25 R101.1 | v72,150 70.75,148.75 70.75,146.5 | v116.25,130.75 117,130 117,108 116.5,107.5 116.5,96.75 118,95.25 R201.1 | v113,133.75 110.75,136 110.75,143.25
  Bottom 0.152: 38.12,143.5 37.75,143.88 37.25,143.88 37.12,143.75 9.12,143.75 9.12,138.88 10.75,137.25 Z0.15 | 38.12,143.5 38.12,142.25 35.62,142.25 Z1-2.12 | v60.12,159.75 63.88,159.75 65.88,157.75 71.5,157.75 v71.62,157.88 | 38.12,143.5 38.38,143.75 55.5,143.75 56.25,144.5 70.62,144.5 v70.88,144.25
  Bottom 0.254: v72,126 67.75,126 67.5,125.75 Z14.5 | v107.75,151.75 99.25,151.75 98.5,151 86,151 85,150 v72,150 | v116.25,130.75 113.25,133.75 v113,133.75
D2  (via drill 0.25)
  Top 0.152: v116.25,121.5 v116.25,112.75 116.25,108.12 116,107.88 116,94.75 118,92.75 R202.1 | v114.75,122.25 114.5,122.5 v114.5,136.75 | v112.75,137.75 111.88,138.62 111.88,139.62 R102.1 | v70,121.25 70.12,121.38 70.12,132 70.25,132.12 70.25,139.38 70.12,139.5 70.12,140.5 70.25,140.62 70.25,141.88 68.62,143.5 Z3-4.13 | v62.25,175.62 64,173.88 64,162.25 64.75,161.5 64.75,154.38 63.62,153.25 63.62,152.75 63.88,152.5 63.88,144 v63.75,143.88 | v46.25,140.75 v44.75,139.25 | v71.75,110.38 71.12,111 71.12,119.62 v71.25,119.75
  Top 0.254: v12.75,140 12.75,143 11,144.75 Z0.12
  Bottom 0.152: v116.25,121.5 115.5,122.25 v114.75,122.25 | v114.5,136.75 113.5,137.75 v112.75,137.75 | 69.75,121.25 67.88,121.25 67.38,120.75 Z14.7 | v62.25,175.62 62.25,180.25 21B.1 | Z3-4.13 68.5,143.62 64,143.62 v63.75,143.88 56.25,143.88 55.75,143.38 48.88,143.38 v46.25,140.75 | v44.75,139.25 35.88,139.25 35.62,139.5 Z1-2.13 | v116.25,112.75 116,112.5 96.12,112.5 94,110.38 v71.75,110.38 | 69.75,121.25 v71.25,119.75 | 69.75,121.25 v70,121.25
  Bottom 0.254: v12.75,140 14.25,138.5 32,138.5 33,139.5 35.5,139.5 Z1-2.13
D3  (via drill 0.25)
  Top 0.254: 12A.1 39.25,180.25 39.25,164.25 v39,164 39.25,163.75 39.25,158.25 40.25,157.25 40.25,138.75 v40,138.5 | v69.25,118.5 69.25,131.75 69.75,132.25 69.75,135.75 v68,137.5 | R203.1 143.5,90 142,90 142,89.75 141.25,89 129,89 129,90 128.5,90.5 128,90.5 125.75,88.25 81.25,88.25 81.25,90.25 80,91.5 76.5,91.5 76.5,116.5 75,118 Z14.9 | v179.5,131.25 179.5,129.5 181.5,127.5 Z27.2 | v139.5,134.25 137.25,136.5 137.25,137 R103.1
  Bottom 0.254: v39,164 9,164 9,156.75 10.75,155 Z0.8 | v69.25,118.5 74.5,118.5 74.75,118.25 Z14.9 | 94.25,137.25 94.25,139 93.75,139.5 85.25,139.5 84,140.75 Z3-4.15 | 94.25,137.25 68.25,137.25 v68,137.5 55.75,137.5 55.5,137.25 51,137.25 Z1-2.15 50.75,137.25 50.25,137.75 40.75,137.75 v40,138.5 | 94.25,137.25 94.5,137 107.75,137 108.75,136 119.75,136 122,138.25 136,138.25 137,137.25 R103.1 | v179.5,131.25 179.25,131.5 159,131.5 156,134.5 150.5,134.5 150.25,134.25 148.5,134.25 148.25,134.5 139.75,134.5 v139.5,134.25
D4  (via drill 0.25)
  Top 0.254: v140.25,121.75 140.25,136.5 137.25,139.5 R104.1 | v141.75,120.25 143.75,118.25 143.75,99.5 142.5,98.25 142.5,93.75 143.5,92.75 R204.1 | v82.25,141.75 83.75,143.25 83.75,143.5 Z3-4.16 | v70.75,139.75 v70.75,123.25 | 11A.1 37,180.25 38.25,179 v38.25,158.5 39.5,157.25 v39.5,140 | v122.5,136 120.75,137.75 v120.75,138
  Bottom 0.254: v141.75,120.25 v140.25,121.75 | v70.75,123.25 74.75,123.25 Z14.11 | v38.25,158.5 12,158.5 11,157.5 Z0.7 | v39.5,140 50.5,140 Z1-2.16 51,139.75 v70.75,139.75 77.75,139.75 79.75,141.75 v82.25,141.75 82.5,142 85,142 87,140 99.5,140 101,138.5 120.25,138.5 v120.75,138 | v122.5,136 138.5,136 138.5,138.25 137.25,139.5 R104.1
D5  (via drill 0.25)
  Top 0.254: v139,141.75 141,139.75 141,118.5 143.25,116.25 143.25,115.5 142,114.25 142,92.75 143.25,91.5 144.75,91.5 144.75,94.25 143.75,95.25 R205.1 | v76,145.5 73.25,142.75 v73.25,142 73.25,130 74.75,128.5 Z14.13 | 45.5,153 47.75,150.75 47.75,145.25 50.75,142.25 Z1-2.17 | 45.5,153 v45,153.5 | v42,171.5 42,180.25 13A.1 | 45.5,153 v45.5,168 | v130,163.25 130,143.75 135.5,143.75 137,142.25 R105.1 | v85.5,160 85.5,147.75 84,146.25 Z3-4.17
  Bottom 0.254: v139,141.75 137.5,141.75 137.25,142 R105.1 | v76,145.5 76.5,146 83.75,146 Z3-4.17 | v73.25,142 67.25,142 67,142.25 51,142.25 Z1-2.17 | v45,153.5 12,153.5 11,152.5 Z0.9 | v45.5,168 v42,171.5 | v130,163.25 128.75,164.5 118.5,164.5 118,164 89.5,164 v85.5,160
D6  (via drill 0.25)